# EAGLE design logic384 (EAGLE 9.1.2)
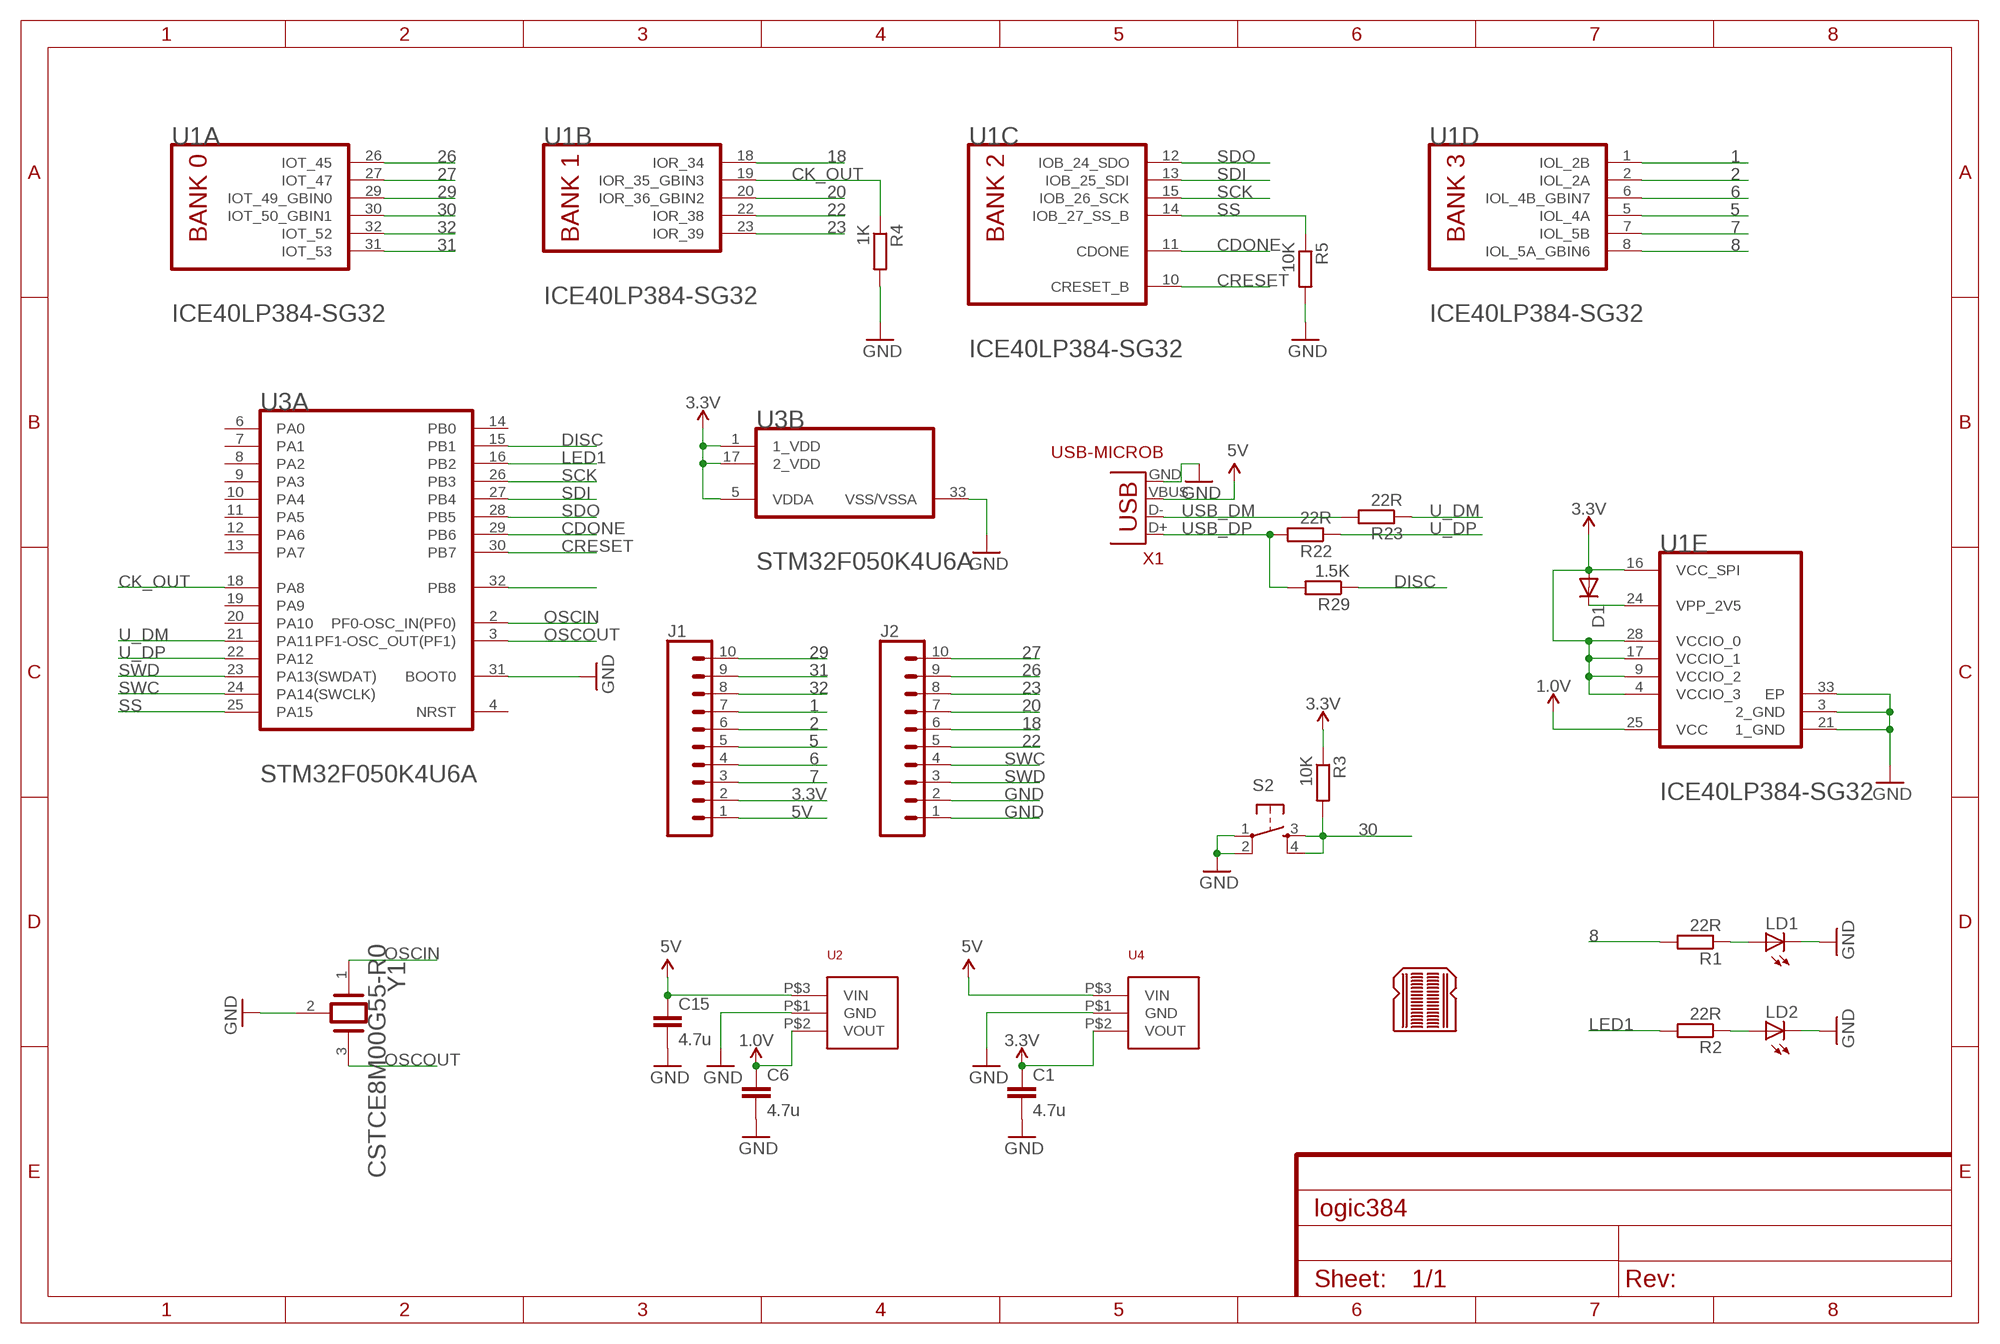
[diagram p0: schematic, sheet 1]

## Parts
C1  4.7u  CAP0402-CAP  [0402-CAP]
C6  4.7u  CAP0402-CAP  [0402-CAP]
C15  4.7u  CAP0402-CAP  [0402-CAP]
D1  DIODE-SOD523  [SOD523]
J1  CONN_10NO_SILK_PTH_FEMALE  [1X10_NO_SILK]
J2  CONN_10NO_SILK_PTH_FEMALE  [1X10_NO_SILK]
LD1  LED0603  [LED-0603]
LD2  LED0603  [LED-0603]
LOGO1  BREADBOARD_PATTERN  [BREADBOARD_SPACING]
R1  22R  R-EU_R0402  [R0402]
R2  22R  R-EU_R0402  [R0402]
R3  10K  R-EU_R0402  [R0402]
R4  1K  R-EU_R0402  [R0402]
R5  10K  R-EU_R0402  [R0402]
R22  22R  R-EU_R0402  [R0402]
R23  22R  R-EU_R0402  [R0402]
R29  1.5K  R-EU_R0402  [R0402]
S2  TAC_SWITCHSMD  [TACTILE_SWITCH_SMD]
U1  LATTICE_SEMICONDUCTOR_ICE40LP384-SG32LATTICE_SEMICONDUCTOR_ICE40LP384-SG32_0_1  [LATTICE_SEMICONDUCTOR_ICE40LP384-SG32_1]
U2  MCP1703SOT-3.3V  MCP1703SOT  [SOT-23A]
U3  STMICROELECTRONICS_STM32F050K4U6ASTMICROELECTRONICS_STM32F050K4U6A_0_1  [STMICROELECTRONICS_STM32F050K4U6A_1]
U4  MCP1703SOT-3.3V  MCP1703SOT  [SOT-23A]
X1  USB-MICROB  [USB-MICROB]
Y1  MURATA_CSTCE8M00G55-R0MURATA_CSTCE8M00G55-R0_0_0  [MURATA_CSTCE8M00G55-R0_0]

## Nets
1: J1.7 U1.1(D:IOL_2B)
1.0V: C6.1 U1.25(E:VCC) U2.P$2(VOUT)
2: J1.6 U1.2(D:IOL_2A)
3.3V: C1.1 D1.A J1.2 R3.1 U1.4(E:VCCIO_3) U1.9(E:VCCIO_2) U1.16(E:VCC_SPI) U1.17(E:VCCIO_1) U1.28(E:VCCIO_0) U3.1(B:1_VDD) U3.5(B:VDDA) U3.17(B:2_VDD) U4.P$2(VOUT)
5: J1.5 U1.5(D:IOL_4A)
5V: C15.1 J1.1 U2.P$3(VIN) U4.P$3(VIN) X1.VBUS
6: J1.4 U1.6(D:IOL_4B_GBIN7)
7: J1.3 U1.7(D:IOL_5B)
8: R1.2 U1.8(D:IOL_5A_GBIN6)
18: J2.6 U1.18(B:IOR_34)
20: J2.7 U1.20(B:IOR_36_GBIN2)
22: J2.5 U1.22(B:IOR_38)
23: J2.8 U1.23(B:IOR_39)
26: J2.9 U1.26(A:IOT_45)
27: J2.10 U1.27(A:IOT_47)
29: J1.10 U1.29(A:IOT_49_GBIN0)
30: R3.2 S2.3 S2.4 U1.30(A:IOT_50_GBIN1)
31: J1.9 U1.31(A:IOT_53)
32: J1.8 U1.32(A:IOT_52)
CDONE: U1.11(C:CDONE) U3.29(A:PB6)
CK_OUT: R4.1 U1.19(B:IOR_35_GBIN3) U3.18(A:PA8)
CRESET: U1.10(C:CRESET_B) U3.30(A:PB7)
DISC: R29.1 U3.15(A:PB1)
GND: C1.2 C6.2 C15.2 J2.1 J2.2 LD1.C LD2.C R4.2 R5.2 S2.1 S2.2 U1.3(E:2_GND) U1.21(E:1_GND) U1.33(E:EP) U2.P$1(GND) U3.31(A:BOOT0) U3.33(B:VSS/VSSA) U4.P$1(GND) X1.GND Y1.2
LED1: R2.2 U3.16(A:PB2)
N$1: LD1.A R1.1
N$2: LD2.A R2.1
N$3: D1.C U1.24(E:VPP_2V5)
N$6: U3.32(A:PB8)
OSCIN: U3.2(A:PF0-OSC_IN(PF0)) Y1.1
OSCOUT: U3.3(A:PF1-OSC_OUT(PF1)) Y1.3
SCK: U1.15(C:IOB_26_SCK) U3.26(A:PB3)
SDI: U1.13(C:IOB_25_SDI) U3.27(A:PB4)
SDO: U1.12(C:IOB_24_SDO) U3.28(A:PB5)
SS: R5.1 U1.14(C:IOB_27_SS_B) U3.25(A:PA15)
SWC: J2.4 U3.24(A:PA14(SWCLK))
SWD: J2.3 U3.23(A:PA13(SWDAT))
U_DM: R23.1 U3.21(A:PA11)
U_DP: R22.1 U3.22(A:PA12)
USB_DM: R23.2 X1.D-
USB_DP: R22.2 R29.2 X1.D+
Unconnected: U3.4(A:NRST) U3.6(A:PA0) U3.7(A:PA1) U3.8(A:PA2) U3.9(A:PA3) U3.10(A:PA4) U3.11(A:PA5) U3.12(A:PA6) U3.13(A:PA7) U3.14(A:PB0) U3.19(A:PA9) U3.20(A:PA10)

## Library data of the parts
C1 C6 C15 = SparkFun:CAP: Capacitor Standard 0603 ceramic capacitor, and 0.1" leaded capacitor.; HEIGHT: 1
D1 = diode:DIODE-: DIODE
J1 J2 = SparkFun-Connectors:CONN_10: Multi connection point. Often used as Generic Header-pin footprint for 0.1 inch spaced/style header connections On any of the 0.1 inch spaced packages, you can populate with these: Break Away Headers - Straight <https://www.sparkfun.com/products/116> (PRT-00116) Break Away Male Headers - Right Angle <https://www.sparkfun.com/products/553> (PRT-00553) Female Headers <https://www.sparkfun.com/products/115> (PRT-00115) Break Away Headers - Machine Pin <https://www.sparkfun.com/products/117> (PRT-00117) Break Away Female Headers - Swiss Machine Pin <https://www.sparkfun.com/products/743> (PRT-00743) Arduino Stackable Header - 10 Pin <https://www.sparkfun.com/products/11376> (PRT-11376) For SCREWTERMINALS and SPRING TERMINALS visit here: Screw Terimnals on SparkFun.com <https://www.sparkfun.com/search/results?term=Screw+Terminals> (5mm/3.5mm/2.54mm spacing) This device is also useful as a general connection point to wire up your design to another part of your project. Our various solder wires solder well into these plated through hole pads. Hook-Up Wire - Assortment (Stranded, 22 AWG) <https://www.sparkfun.com/products/11375> (PRT-11375) Hook-Up Wire - Assortment (Solid Core, 22 AWG) <https://www.sparkfun.com/products/11367> (PRT-11367) View the entire wire category on our website here <https://www.sparkfun.com/categories/141> Special notes: Molex polarized connector foot print use with SKU : PRT-08231 with associated crimp pins and housings. 1MM SMD Version SKU: PRT-10208 NOTES ON THE VARIANTS LOCK and LOCK_LONGPADS... This footprint was designed to help hold the alignment of a through-hole component (i.e. 6-pin header) while soldering it into place. You may notice that each hole has been shifted either up or down by 0.005 of an inch from it's more standard position (which is a perfectly straight line). This slight alteration caused the pins (the squares in the middle) to touch the edges of the holes. Because they are alternating, it causes a "brace" to hold the component in place. 0.005 has proven to be the perfect amount of "off-center" position when using our standard breakaway headers. Although looks a little odd when you look at the bare footprint, once you have a header in there, the alteration is very hard to notice. Also,if you push a header all the way into place, it is covered up entirely on the bottom side.; PROD_ID: CONN-11563
LD1 LD2 = SparkFun:LED: LEDs Standard schematic elements and footprints for 5mm, 3mm, 1206, and 0603 sized LEDs. 5mm - Spark Fun Electronics SKU : COM-00529 (and others)
LOGO1 = SparkFun-Aesthetics:BREADBOARD_PATTERN: Breadboard-Spacing Reference tDoc reference markings that correspond to solderless breadboard row spacing. Includes power rails and void space between rows.
R1-R5 R22 R23 R29 = resistor:R-EU_: RESISTOR, European symbol
S2 = icedrink:TAC_SWITCH: Momentary Switch Button commonly used for reset or general input. Spark Fun Electronics SKU : COM-00097
U1 = Lattice Semiconductor - ICE40LP384-SG32:LATTICE_SEMICONDUCTOR_ICE40LP384-SG32: LATC-LP384-QFN-32; CIIVA_IDS: 8919028; COMPONENT_LINK_1_DESCRIPTION: Manufacturer URL; COMPONENT_LINK_1_URL: http://www.latticesemi.com/en; COMPONENT_LINK_3_DESCRIPTION: Package Specification; COMPONENT_LINK_3_URL: http://www.latticesemi.com/lit/docs/package/pkg.pdf; DATASHEET: http://www.latticesemi.com/~/media/Documents/DataSheets/iCE/iCE40LPHXFamilyDataSheet.pdf; DATASHEET_VERSION: Rev. 02.9; FOOTPRINT_VARIANT_NAME_0: Level C; FOOTPRINT_VARIANT_NAME_1: Level B; FOOTPRINT_VARIANT_NAME_2: Level A; IMPORTED: yes; IMPORTED_FROM: vault; IMPORT_TS: 1521843166; LOGIC_CELLS: 384; MF: Lattice Semiconductor; MOUNTING_TECHNOLOGY: Surface Mount; MPN: ICE40LP384-SG32; PACKAGE: QFN-32; PACKAGE_DESCRIPTION: 32-Pin Quad Flat No-lead, Body 5 x 5 mm, Pitch 0.5 mm; PACKAGE_VERSION: Rev. 03.9, 02/2013; PACKING: Tray; PIN_0_0_2_INSIDE_EDGE: clock; PIN_0_0_3_INSIDE_EDGE: clock; PIN_0_1_1_INSIDE_EDGE: clock; PIN_0_1_2_INSIDE_EDGE: clock; PIN_0_2_5_INSIDE_EDGE: clock; PIN_0_3_3_INSIDE_EDGE: clock; PIN_0_3_5_INSIDE_EDGE: clock; PREFIX: U; RELEASE_DATE: 1399324776; ROHS: Yes; SUPPLY_VOLTAGE: 1.2V; VAULT_GUID: 2D6C6621-1DFA-4142-B8DF-6BF06AB097DA; VAULT_REVISION: 109DA72E-2B91-450C-BFE0-8AD290CDB480
U2 U4 = icedrink:MCP1703
U3 = STMicroelectronics - STM32F050K4U6A:STMICROELECTRONICS_STM32F050K4U6A: MC-ARM-STM32F050-SQ33; CIIVA_IDS: 3249022; COMPONENT_LINK_1_DESCRIPTION: Manufacturer URL; COMPONENT_LINK_1_URL: http://www.st.com/web/en/home.html; COMPONENT_LINK_3_DESCRIPTION: Package Specification; COMPONENT_LINK_3_URL: http://www.st.com/st-web-ui/static/active/en/resource/technical/document/datasheet/DM00039193.pdf; CORE: ARM Cortex-M0; DATASHEET: http://www.st.com/st-web-ui/static/active/en/resource/technical/document/datasheet/DM00065136.pdf; DATASHEET_VERSION: Rev. 1; FLASH_SIZE_PROG_KB: 16; FOOTPRINT_VARIANT_NAME_0: Level C; FOOTPRINT_VARIANT_NAME_1: Level B; FOOTPRINT_VARIANT_NAME_2: Level A; IMPORTED: yes; IMPORTED_FROM: vault; IMPORT_TS: 1521852691; INTERNAL_RAM_SIZE_KB: 4; IOS_HIGH_CURRENT: 27; MF: STMicroelectronics; MOUNTING_TECHNOLOGY: Surface Mount; MPN: STM32F050K4U6A; OPERATING_FREQUENCYF_PROCESSOR_SPEED_MHZ: 48; PACKAGE: UFQFPN32; PACKAGE_DESCRIPTION: 32-Pin Ultra Thin Fine Pitch Quad Flat No-Lead, 5 x 5 x 0.6 mm Body, 0.5 mm Pitch, Exposed Pad; PACKAGE_VERSION: Rev. 3, 07/2012; PACKING: Tray; PREFIX: U; RELEASE_DATE: 1387182902; SUPPLY_VOLTAGEVCC_MIN_V: 2; VAULT_GUID: 1D501A81-2253-4CCE-AD6F-01C2C2EE7641; VAULT_REVISION: 8F0ACF05-681F-4409-A455-CAED69E222AA
X1 = icedrink:USB: USB Connectors USB-B-PTH is fully proven SKU : PRT-00139 USB-miniB is fully proven SKU : PRT-00587 USB-A-PCB is untested. USB-A-H is throughly reviewed, but untested. Spark Fun Electronics SKU : PRT-00437 USB-B-SMT is throughly reviewed, but untested. Needs silkscreen touching up. USB-A-S has not been used/tested USB-MB-H has not been used/tested
Y1 = Murata - CSTCE8M00G55-R0:MURATA_CSTCE8M00G55-R0: Ceramic Resonators (CERALOCK); CENTROID_NOT_SPECIFIED: No; DATASHEET: http://www.murata.com/~/media/webrenewal/support/library/catalog/products/timingdevice/ceralock/p16e.ashx; DIGIKEY_DESCRIPTION: CRYS CER RES 8.0000MHZ 33PF SMD; DIGIKEY_PART_NUMBER: 490-1195-1-ND; FREQUENCY: 8.00 MHz; IMPORTED_FROM: octopart; LEAD_FREE: yes; MF: Murata; MOUNTING_TYPE: surface mount; MOUSER_PART_NUMBER: 81-CSTCE8M00G55-R0; MPN: CSTCE8M00G55-R0; NUM_PINS: 3; OCTOPART_PART_NUMBER: 60b0a9be89d7bf77; PACKAGE: SMT_XTAL_3MM2_1MM3; PREFIX: Y; ROHS: yes; SIZE_HEIGHT: 0.70 mm; SIZE_LENGTH: 0.00m; SIZE_WIDTH: 1.30 mm; SYMBOL_0_0: Three Pin Resonator; TEMPERATURE_RANGE_HIGH: +80°C; TEMPERATURE_RANGE_LOW: -20°C; TYPE: oscillator

## Net classes
0 default: clearance 0.205 mm

## Board
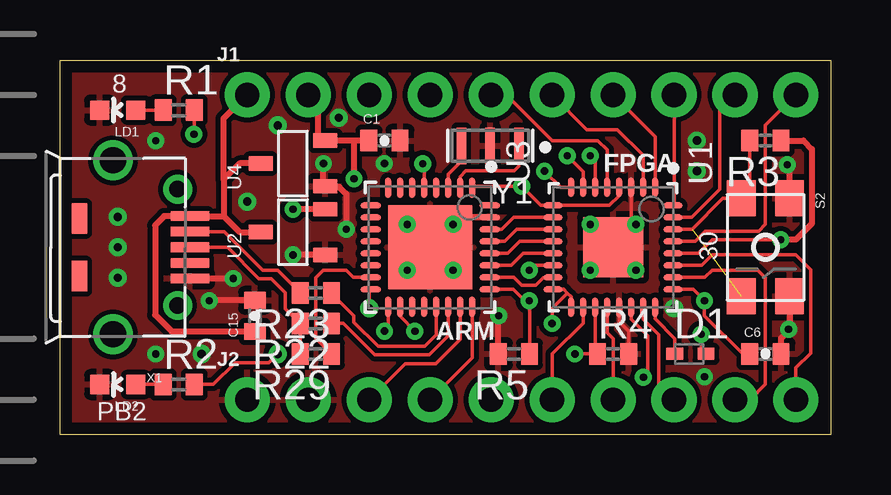
[diagram p1: board, top side]
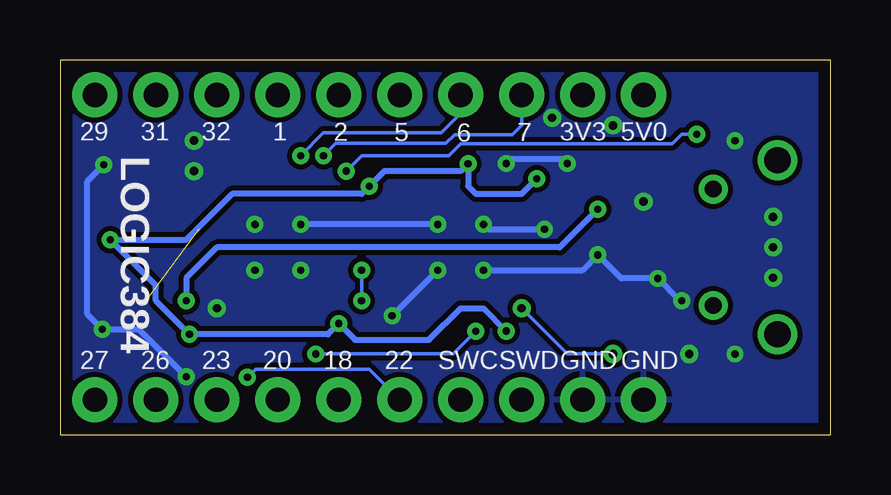
[diagram p2: board, bottom side, seen from below]

Size 32.12 x 15.61 mm. Coordinates in mm from the lower left corner, seen from the top.
Outline: 0,7.8 0,15.61 32.12,15.61 32.12,0 0,0 0,7.8
Copper layers (1*16): Top 0.035mm / dielectric 1.5mm / Bottom 0.035mm
Design rules "default *": minimum track width 6mil, minimum drill 0.3mm, track to track 6mil, track to pad 6mil, pad to pad 6mil, via to via 6mil, smd to smd 6mil, copper to edge 0.5mm, drill to drill 6mil, minimum pad ring 10mil, minimum via ring 8mil, stop-mask expansion 4mil, vias tented up to drill 40mil, thermal gap 10mil

### Footprints (pad centres in the part's own frame; a part is rotated, then mirrored left to right if it is on the bottom)
0402-CAP = smd 0.7 x 0.9: 1 -0.65,0; 2 0.65,0
SOD523 = smd 0.7 x 0.5: A 0.7,0; C -0.6,0
1X10_NO_SILK = drill 1.016 pad 1.88: 1 0,0; 2 2.54,0; 3 5.08,0; 4 7.62,0; 5 10.16,0; 6 12.7,0; 7 15.24,0; 8 17.78,0; 9 20.32,0; 10 22.86,0
LED-0603 = smd 0.8 x 0.8: A 0,-0.75; C 0,0.75
R0402 = smd 0.7 x 0.9: 1 -0.65,0; 2 0.65,0
TACTILE_SWITCH_SMD = smd 1.5 x 1.2: 1 -2.04,1.005; 2 2.04,1.005; 3 -2.04,-1.005; 4 2.04,-1.005
LATTICE_SEMICONDUCTOR_ICE40LP384-SG32_1 = smd 0.8 x 0.25: 1 -2.5,1.75; 2 -2.5,1.25; 3 -2.5,0.75; 4 -2.5,0.25; 5 -2.5,-0.25; 6 -2.5,-0.75; 7 -2.5,-1.25; 8 -2.5,-1.75; 17 2.5,-1.75; 18 2.5,-1.25; 19 2.5,-0.75; 20 2.5,-0.25; 21 2.5,0.25; 22 2.5,0.75; 23 2.5,1.25; 24 2.5,1.75 | smd 0.25 x 0.8: 9 -1.75,-2.5; 10 -1.25,-2.5; 11 -0.75,-2.5; 12 -0.25,-2.5; 13 0.25,-2.5; 14 0.75,-2.5; 15 1.25,-2.5; 16 1.75,-2.5; 25 1.75,2.5; 26 1.25,2.5; 27 0.75,2.5; 28 0.25,2.5; 29 -0.25,2.5; 30 -0.75,2.5; 31 -1.25,2.5; 32 -1.75,2.5 | smd 2.5 x 2.5: 33 0,0
SOT-23A = smd 0.6 x 1: P$1 -0.95,-1.35; P$2 0.95,-1.35; P$3 0,1.35
STMICROELECTRONICS_STM32F050K4U6A_1 = smd 0.85 x 0.25: 1 -2.475,1.75; 2 -2.475,1.25; 3 -2.475,0.75; 4 -2.475,0.25; 5 -2.475,-0.25; 6 -2.475,-0.75; 7 -2.475,-1.25; 8 -2.475,-1.75; 17 2.475,-1.75; 18 2.475,-1.25; 19 2.475,-0.75; 20 2.475,-0.25; 21 2.475,0.25; 22 2.475,0.75; 23 2.475,1.25; 24 2.475,1.75 | smd 0.25 x 0.85: 9 -1.75,-2.475; 10 -1.25,-2.475; 11 -0.75,-2.475; 12 -0.25,-2.475; 13 0.25,-2.475; 14 0.75,-2.475; 15 1.25,-2.475; 16 1.75,-2.475; 25 1.75,2.475; 26 1.25,2.475; 27 0.75,2.475; 28 0.25,2.475; 29 -0.25,2.475; 30 -0.75,2.475; 31 -1.25,2.475; 32 -1.75,2.475 | smd 3.5 x 3.5: 33 0,0
USB-MICROB = smd 0.4 x 1.6: D+ 0,-3.2; D- 0.65,-3.2; GND -1.3,-3.2; ID -0.65,-3.2; VBUS 1.3,-3.2 | drill 1.1: P$1 -3.625,0; P$2 3.625,0 | drill 0.7: P$3 -2.425,-2.68; P$4 2.425,-2.68 | smd 1.27 x 0.635: P$5 -1.2,1.4; P$6 1.2,1.4
MURATA_CSTCE8M00G55-R0_0 = smd 0.4 x 1.524: 1 -1.2,0; 2 0,0; 3 1.2,0

### Placement (x,y rotation side)
C1  13.52,12.25 0 top
C6  29.39,3.36 0 top
C15  8.12,4.95 90 top
D1  26.22,3.36 0 top
J1  7.8,14.15 0 top
J2  7.8,1.45 0 top
LD1  2.41,13.52 90 top
LD2  2.41,2.09 90 top
LOGO1  -2.36,7.8 90 top
R1  4.95,13.52 0 top
R2  4.95,2.09 0 top
R3  29.39,12.25 180 top
R4  23.04,3.36 0 top
R5  18.92,3.36 180 top
R22  10.66,4.63 180 top
R23  10.66,5.9 180 top
R29  10.66,3.36 180 top
S2  29.39,7.8 270 top
U1  23.04,7.8 270 top
U2  9.71,8.44 90 top
U3  15.42,7.8 270 top
U4  9.71,11.3 90 top
X1  2.22,7.8 90 top
Y1  17.92,12.03 180 top

### Tracks (layer width: path | path; a pad name or v marks a point on that pad's centre or on a via)
1
  Top 0.152: U1.1 24.79,12.4 J1.7
1.0V  (via drill 0.3 pad 0.6)
  Top 0.152: U1.25 26.38,6.05 v26.85,5.58 26.85,4.95 28.44,3.36 C6.1
  Top 0.254: U2.P$2 v9.71,9.39
  Bottom 0.254: v26.85,5.58 26.85,6.53 25.58,7.8 11.3,7.8 v9.71,9.39
2
  Top 0.152: U1.2 24.29,11.63 23.23,12.7 21.96,12.7 J1.6
3.3V  (via drill 0.3 pad 0.6)
  Top 0.152: U1.28 26.6,7.55 27.17,8.12 v30.03,8.12 | v26.72,4.18 26.72,3.56 D1.A | U1.4 23.29,9.96 22.89,9.55 U1.9 20.03,9.55 v19.23,10.35 17.24,10.35 U3.1 | U1.16 20.98,6.05 21.14,5.9 | U1.17 21.29,5.74 21.14,5.9 | U3.17 13.67,4.47 v13.52,4.31 | U3.5 15.17,11.23 v15.12,11.29 | 21.14,5.9 20.5,5.26 v20.5,4.63
  Top 0.254: C1.1 12.25,12.25 | U4.P$2 11.93,12.25 12.25,12.25 | U4.P$2 | J1.2 10.74,13.75 10.74,12.25 U4.P$2 | 12.25,12.25 v12.25,10.66 | R3.1 30.98,12.25 31.33,11.9 31.33,8.79 30.66,8.12 v30.03,8.12
  Bottom 0.254: v13.52,4.31 14.47,5.26 15.42,5.26 16.74,3.94 19.82,3.94 v20.5,4.63 20.95,4.18 v26.72,4.18 28.12,5.58 28.12,6.22 v30.03,8.12 26.85,8.12 24.95,10.03 19.55,10.03 v19.23,10.35 18.6,10.98 15.42,10.98 v15.12,11.29 15.12,10.35 14.79,10.03 12.88,10.03 v12.25,10.66
5
  Top 0.152: U1.5 22.79,11.86 22.41,12.25 20.5,12.25 18.6,14.15 J1.5
5V
  Top 0.254: 6.82,9.1 X1.VBUS 4.34,9.1 3.96,8.72 3.96,4.99 4.66,4.3 C15.1 | 6.82,9.1 7.49,8.44 U2.P$3 | U4.P$3 7.49,11.3 6.82,10.63 | 6.82,10.63 6.82,9.1 | 6.82,10.63 6.82,13.17 J1.1
6  (via drill 0.3 pad 0.6)
  Top 0.152: U1.6 22.29,11.41 v22.09,11.61
  Bottom 0.152: J1.4 15.42,13.39 16.24,12.57 21.14,12.57 v22.09,11.61
7  (via drill 0.3 pad 0.6)
  Top 0.152: U1.7 21.79,10.96 v21.14,11.61
  Bottom 0.152: J1.3 12.88,12.88 13.26,12.5 15.67,12.5 16.05,12.13 20.62,12.13 v21.14,11.61
8  (via drill 0.3 pad 0.6)
  Top 0.152: U1.8 20.86,10.3 v20.19,10.98 | R1.2 5.6,12.53 v5.58,12.51
  Bottom 0.152: v20.19,10.98 19.55,11.61 15.93,11.61 15.41,12.13 6.6,12.13 6.22,12.51 v5.58,12.51
18
  Top 0.152: U1.18 21.79,4.65 20.5,3.36 J2.6
20
  Top 0.152: U1.20 22.79,4.24 23.04,3.99 J2.7
22  (via drill 0.3 pad 0.6)
  Top 0.152: U1.22 23.79,4.81 24.49,4.12 24.49,2.56 v24.31,2.39
  Bottom 0.152: J2.5 19.23,2.72 23.97,2.72 v24.31,2.39
23
  Top 0.152: U1.23 24.29,4.81 24.94,4.16 24.94,2.09 J2.8
26
  Top 0.152: U1.26 26.87,6.55 27.17,6.85 29.08,6.85 29.39,6.53 29.39,2.09 28.76,1.45 J2.9
27
  Top 0.152: U1.27 26.74,7.05 27.17,7.49 30.66,7.49 31.28,6.87 31.28,3.4 30.66,2.78 J2.10
29
  Top 0.152: U1.29 26.47,8.05 26.89,8.48 29.12,8.48 29.39,8.76 29.39,12.88 J1.10
30  (1 unrouted)
  Top 0.152: U1.30 26.33,8.55 27.62,9.84 S2.3 28.74,10.2 R3.2
31
  Top 0.152: U1.31 26.33,9.05 27.49,10.21 27.49,13.52 J1.9
32
  Top 0.152: U1.32 25.58,9.59 J1.8
CDONE
  Top 0.152: U3.29 18.53,8.05 19.03,8.55 U1.11
CK_OUT  (via drill 0.3 pad 0.6)
  Top 0.152: U1.19 22.29,3.46 R4.1 v21.46,3.36 | U3.18 14.17,4.93 v14.79,4.31
  Bottom 0.152: v21.46,3.36 15.74,3.36 v14.79,4.31
CRESET
  Top 0.152: U3.30 18.4,8.55 18.9,9.05 U1.10
DISC
  Top 0.152: U3.15 12.23,6.55 11.93,6.85 10.98,6.85 10.66,6.53 10.66,4.01 R29.1
GND  (via drill 0.3 pad 0.6, 0.35)
  Top 0.152: U1.21 23.29,4.7 23.69,4.3 R4.2 | U1.33 23.2,7.65 23.79,8.24 U1.3
  Top 0.254: X1.GND v7.21,6.5 | C15.2 6.23,5.6 v6.22,5.58 | v10.98,11.3 10.98,10.43 U4.P$1 11.6,10.35 11.93,10.01 v11.93,8.56 | U1.33 v22.09,8.76 | U1.33 v24,8.76 | U1.33 v24,6.85 | U1.33 v22.09,6.85 | U3.33 v14.47,8.76 | U3.33 v16.38,8.76 16.67,9.05 U3.31 | U3.33 v16.38,6.85 | U3.33 v14.47,6.85 | R5.2 18.27,4.93 v18.28,4.95 | S2.2 30.4,4.44 | 30.4,4.44 v30.36,4.4 | C6.2 30.04,4.01 30.4,4.36 30.4,4.44 | U2.P$1 v9.71,7.49 | S2.1 30.4,11.14 v30.3,11.24
  Bottom 0.254: v13.52,11.3 13.33,11.48 11.17,11.48 v10.98,11.3 | v16.38,6.85 v18.28,4.95 | v14.47,8.76 14.28,8.56 v11.93,8.56 | v14.47,6.85 10.34,6.85 v9.71,7.49 8.73,6.5 v7.21,6.5 6.29,5.58 v6.22,5.58 | v30.3,11.24 30.98,10.56 30.98,5.02 v30.36,4.4 28.84,4.4 v26.85,2.41 | v16.38,8.76 v22.09,8.76
  other vias: 3.99,12.25 3.99,3.36 25.58,5.26 2.41,9.07 2.41,7.8 2.41,6.53 11.61,13.2 9.07,12.88 26.54,12.25 26.54,10.98 5.9,3.36 7.8,9.71
  pour Top (isolate 0.051): -0.13,15.74 32.25,15.74 32.25,-0.13 -0.13,-0.13
  pour Bottom (isolate 0.051): -0.77,16.38 32.89,16.38 32.89,11.93 32.89,-0.45 13.2,-0.45 -0.77,-0.45
LED1  (via drill 0.35)
  Top 0.152: U3.16 12.88,6.05 v12.88,5.26 | R2.2 6.4,2.09 7.3,2.99 8.71,2.99 v9.07,3.36
  Bottom 0.152: v12.88,5.26 10.98,3.36 v9.07,3.36
N$1
  Top 0.152: LD1.A R1.1
N$2
  Top 0.152: LD2.A R2.1
N$3
  Top 0.152: U1.24 24.79,4.82 25.62,3.99 D1.C
OSCIN
  Top 0.152: U3.2 16.67,10.75 16.91,10.99 18.92,10.99 19.12,11.18 Y1.1
OSCOUT
  Top 0.152: U3.3 16.17,10.85 16.72,11.39 Y1.3
SCK
  Top 0.152: U1.15 20.52,6.53 20.13,6.53 19.81,6.22 19.23,6.22 18.9,6.55 U3.26
SDI
  Top 0.152: U3.27 18.8,7.05 19.3,7.55 U1.13
SDO
  Top 0.152: U3.28 18.67,7.55 19.17,8.05 U1.12
SS  (via drill 0.3 pad 0.6)
  Top 0.152: U1.14 19.75,7.05 v19.55,6.85 | U3.25 18.89,6.05 19.36,5.58 v19.55,5.58 19.57,5.57 R5.1
  Bottom 0.152: v19.55,6.85 v19.55,5.58
SWC
  Top 0.152: J2.4 17.17,3.2 U3.24
SWD
  Top 0.152: U3.23 16.67,3.97 15.66,2.96 14.39,2.96 J2.3
U_DM
  Top 0.152: U3.21 15.67,4.16 15.19,3.68 13.26,3.68 12.25,4.69 12.25,4.95 R23.1
U_DP
  Top 0.152: U3.22 16.17,4.11 15.38,3.32 13.11,3.32 11.8,4.63 R22.1
USB_DM
  Top 0.152: X1.D- 6.84,8.45 8.44,6.85 9.07,6.85 10.01,5.91 R23.2
USB_DP
  Top 0.152: X1.D+ 6.98,7.8 8.29,6.49 8.8,6.49 9.38,5.91 9.38,5.33 9.39,5.32 9.39,5.25 R22.2 R29.2

### Text on the board
tPlace: 8 | FPGA | 30 | ARM | PB2
bPlace: 5V0 | 3V3 | 7 | 6 | 5 | 2 | 1 | 32 | 31 | LOGIC384 | 29 | GND | GND | SWD | SWC | 22 | 18 | 20 | 23 | 26 | 27
bStop: BUPT | REV1